# EAGLE design osccds (EAGLE 6.4)
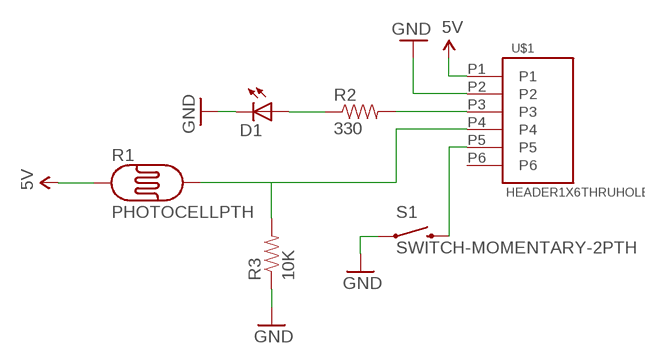
[diagram p0: schematic, sheet 1]

## Parts
D1  LED3MM  [LED3MM]
R1  PHOTOCELLPTH  [PHOTOCELL]
R2  330  RESISTORPTH1  [AXIAL-0.3]
R3  10K  RESISTORPTH1  [AXIAL-0.3]
S1  SWITCH-MOMENTARY-2PTH  [TACTILE-PTH]
U$1  HEADER1X6THRUHOLE  [HEADER1X6-TH]

## Nets
5V: R1.1 U$1.P1
GND: D1.K(C) R3.P$1 S1.1 U$1.P2
N$1: R2.P$2 U$1.P3
N$2: D1.A R2.P$1
N$3: R1.2 R3.P$2 U$1.P4
N$4: S1.3 U$1.P5
Unconnected: U$1.P6

## Library data of the parts
D1 = SparkFun:LED: LEDs Standard schematic elements and footprints for 5mm, 3mm, 1206, and 0603 sized LEDs. 5mm - Spark Fun Electronics SKU : COM-00529 (and others)
R1 = SparkFun:PHOTOCELL
R2 R3 = SparkFun:RESISTOR: Resistor Basic schematic elements and footprints for 0603, 1206, and PTH 1/10th watt (small) resistors.
S1 = SparkFun:SWITCH-MOMENTARY-2
U$1 = osufeh:HEADER1X6

## Board
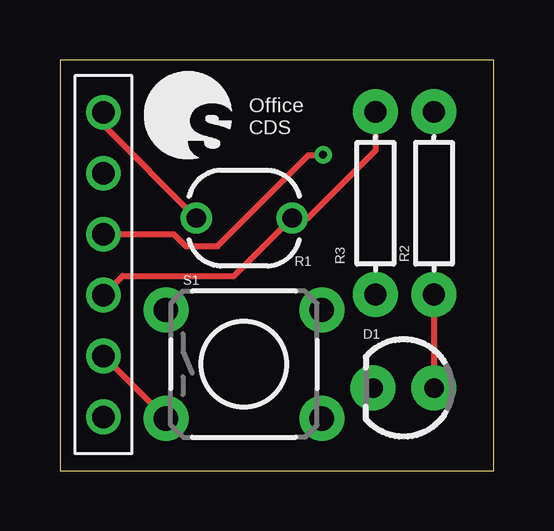
[diagram p1: board, top side]
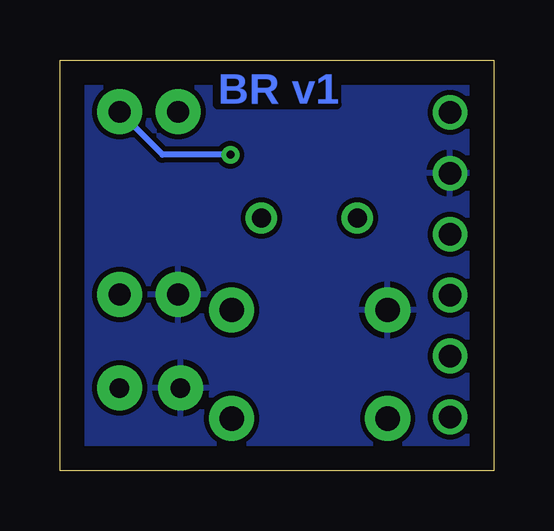
[diagram p2: board, bottom side, seen from below]

Size 18.09 x 17.14 mm. Coordinates in mm from the lower left corner, seen from the top.
Outline: 0,0 18.09,0 18.09,17.14 0,17.14 0,0
Copper layers (1*16): Top 0.035mm / dielectric 1.5mm / Bottom 0.035mm
Design rules "default": minimum track width 10mil, minimum drill 24mil, track to track 8mil, track to pad 8mil, pad to pad 8mil, via to via 8mil, smd to smd 8mil, copper to edge 40mil, drill to drill 8mil, minimum pad ring 10mil, minimum via ring 8mil, stop-mask expansion 4mil, vias tented up to drill 0mil, thermal gap 10mil

### Footprints (pad centres in the part's own frame; a part is rotated, then mirrored left to right if it is on the bottom)
LED3MM = drill 0.813 pad 1.88: A -1.27,0; K 1.27,0
PHOTOCELL = drill 0.8: 1 -2,0; 2 2,0
AXIAL-0.3 = drill 0.9 pad 1.88: P$1 -3.81,0; P$2 3.81,0
TACTILE-PTH = drill 1.016 pad 1.88: 1 -3.251,2.261; 2 3.251,2.261; 3 -3.251,-2.261; 4 3.251,-2.261
HEADER1X6-TH = drill 0.94: P1 0,6.35; P2 0,3.81; P3 0,1.27; P4 0,-1.27; P5 0,-3.81; P6 0,-6.35

### Placement (x,y rotation side)
D1  14.33,3.45 180 top
R1  7.68,10.54 0 top
R2  15.6,11.16 90 top
R3  13.16,11.16 90 top
S1  7.67,4.45 0 top
U$1  1.82,8.6 0 top

### Tracks (layer width: path | path; a pad name or v marks a point on that pad's centre or on a via)
5V
  Top 0.254: U$1.P1 1.82,14.41 R1.1
GND
  pour Bottom: 0,17.14 17.78,17.14 17.78,0 0,0
N$1  (via drill 0.33)
  Top 0.254: U$1.P3 4.75,9.87 5.25,9.37 6.58,9.37 10.36,13.16 10.95,13.16 v10.97,13.18
  Bottom 0.254: v10.97,13.18 13.8,13.18 R2.P$2
N$2
  Top 0.254: R2.P$1 D1.A
N$3
  Top 0.254: R3.P$2 13.17,13.37 10.34,10.54 R1.2 7.27,8.13 2.62,8.13 U$1.P4
N$4
  Top 0.254: U$1.P5 S1.3

### Text on the board
Bottom: BR v1
tPlace: Office / CDS | C:/Users/Ben/Files/Projects/OSC CDS/OpenSource Logo.bmp
tNames: C:/Users/Ben/Files/Projects/OSC CDS/OpenSource Logo.bmp